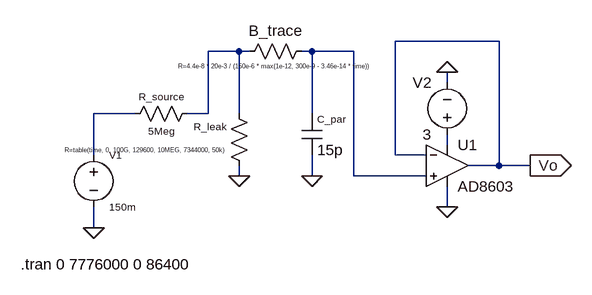
[diagram p0: schematic VisualSim.asc]
VisualSim.asc, the LTspice schematic file:
Version 4.1
SHEET 1 888 680
WIRE 624 -32 464 -32
WIRE 224 -16 176 -16
WIRE 240 -16 224 -16
WIRE 336 -16 320 -16
WIRE 400 -16 336 -16
WIRE 544 32 544 16
WIRE 64 80 0 80
WIRE 176 80 176 -16
WIRE 176 80 144 80
WIRE 224 80 224 -16
WIRE 336 80 336 -16
WIRE 544 128 544 112
WIRE 0 144 0 80
WIRE 464 144 464 -32
WIRE 512 144 464 144
WIRE 624 160 624 -32
WIRE 624 160 576 160
WIRE 672 160 624 160
WIRE 224 176 224 160
WIRE 336 176 336 144
WIRE 400 176 400 -16
WIRE 512 176 400 176
WIRE 544 224 544 192
WIRE 0 256 0 224
FLAG 0 256 0
FLAG 224 176 0
FLAG 336 176 0
FLAG 672 160 Vo
IOPIN 672 160 Out
FLAG 544 16 0
FLAG 544 224 0
SYMBOL voltage 0 128 R0
WINDOW 0 24 16 Left 1
WINDOW 3 24 96 Left 1
WINDOW 123 0 0 Left 0
WINDOW 39 0 0 Left 0
SYMATTR InstName V1
SYMATTR Value 150m
SYMBOL res 160 64 R90
WINDOW 0 0 56 VBottom 1
WINDOW 3 32 56 VTop 1
SYMATTR InstName R_source
SYMATTR Value 5Meg
SYMBOL OpAmps\\AD8603 544 96 R0
SYMATTR InstName U1
SYMBOL res 336 -32 R90
WINDOW 0 0 56 VBottom 2
WINDOW 3 32 56 VTop 0
SYMATTR InstName B_trace
SYMATTR Value R=4.4e-8 * 20e-3 / (150e-6 * max(1e-12, 300e-9 - 3.46e-14 * time))
SYMBOL cap 320 80 R0
WINDOW 0 24 8 Left 1
SYMATTR InstName C_par
SYMATTR Value 15p
SYMBOL res 240 176 R180
WINDOW 0 36 76 Left 1
WINDOW 3 36 40 Left 0
SYMATTR InstName R_leak
SYMATTR Value R=table(time, 0, 100G, 129600, 10MEG, 7344000, 50k)
SYMBOL voltage 544 128 R180
WINDOW 0 24 96 Left 2
WINDOW 3 24 16 Left 2
WINDOW 123 0 0 Left 0
WINDOW 39 0 0 Left 0
SYMATTR InstName V2
SYMATTR Value 3
TEXT -112 312 Left 2 !.tran 0 7776000 0 86400

The netlist it stands for:
* VisualSim.asc
V1 N003 0 150m
R_source N001 N003 5Meg
X§U1 N002 Vo N004 0 Vo AD8603  ; pins In+ In- V+ V- OUT
R§B_trace N002 N001 R=4.4e-8 * 20e-3 / (150e-6 * max(1e-12, 300e-9 - 3.46e-14 * time))
C_par N002 0 15p
R_leak 0 N001 R=table(time, 0, 100G, 129600, 10MEG, 7344000, 50k)
V2 N004 0 3
.tran 0 7776000 0 86400
.backanno
.end